# Altium project ClassD_Amp.PrjPcb
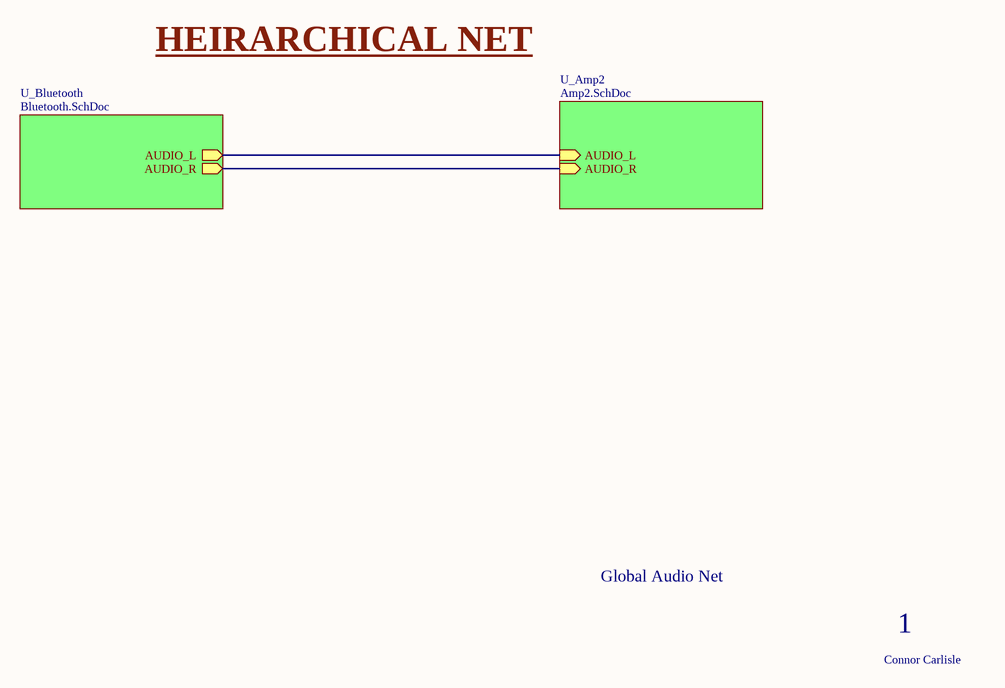
[diagram p0: Top_Sheet.SchDoc]
3 sheets, 68 parts. Net scope: hierarchical (ports join the sheet entries above them; power ports are global).
Board file: PCB1.PcbDoc
Sheets:
  Top_Sheet.SchDoc
    U_Amp2 = Amp2.SchDoc
    U_Bluetooth = Bluetooth.SchDoc

## Sheet Top_Sheet.SchDoc
size A; SheetNumber: 1; SheetTotal: 3

### Sub-sheets
U_Amp2 = Amp2.SchDoc: AUDIO_L (in), AUDIO_R (in)
U_Bluetooth = Bluetooth.SchDoc: AUDIO_L (out), AUDIO_R (out)

### Nets
NetR2_1: sheet U_Amp2/AUDIO_L, sheet U_Bluetooth/AUDIO_L
NetR4_1: sheet U_Amp2/AUDIO_R, sheet U_Bluetooth/AUDIO_R

### Notes on the sheet
- HEIRARCHICAL NET
- Global Audio Net
- 1
- Connor Carlisle

## Sheet Amp2.SchDoc
size A; SheetNumber: 2; SheetTotal: 3
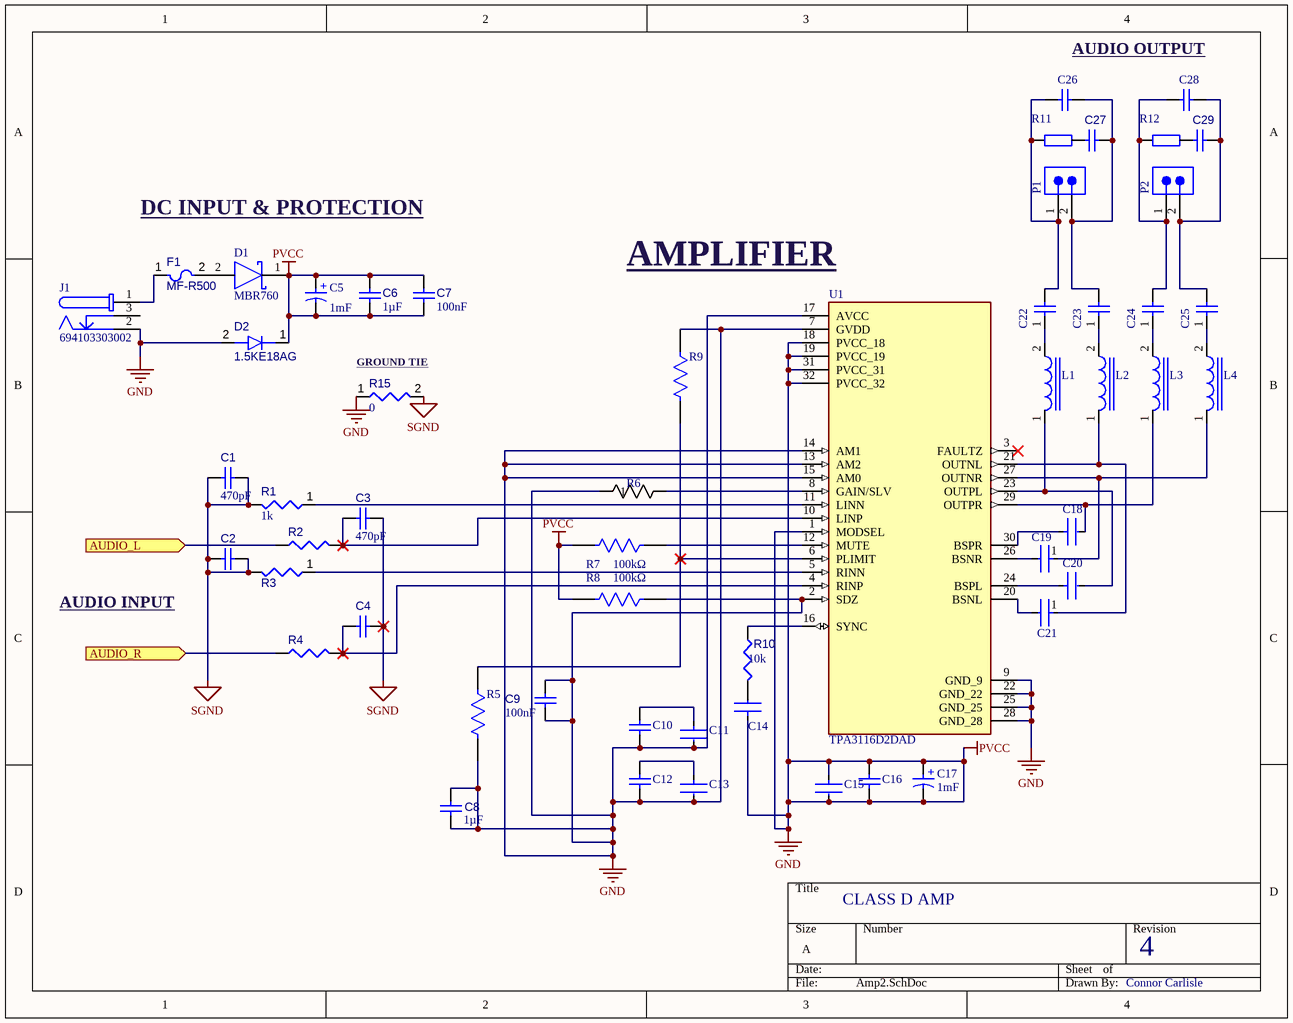
[diagram p1: Amp2.SchDoc]

### Parts
C1  value 470pF  [CAPC0402(1005)60_L]  (hidden comment: Capacitor 470pF +/-20% 50V 0402)
C2  Capacitor 470pF +/-20% 50V 0402  [CAPC0402(1005)60_L]  (value not drawn)
C3  value 470pF  [CAPC0402(1005)60_L]  (hidden comment: Capacitor 470pF +/-20% 50V 0402)
C4  Capacitor 470pF +/-20% 50V 0402  [CAPC0402(1005)60_L]  (value not drawn)
C5  Capacitance: 1mF  [WCAP-ATG8_D10H20]  (hidden comment: 860010475017)
C6  value 1µF  [CAPC0402(1005)60_L]  (hidden comment: Capacitor 1µF +/-20% 10V 0402)
C7  value 100nF  [CAPC0402(1005)60_L]  (hidden comment: Capacitor 100nF +/-20% 25V 0402)
C8  value 1µF  [CAPC0402(1005)60_L]  (hidden comment: Capacitor 1µF +/-20% 10V 0402)
C9  value 100nF  [CAPC0402(1005)60_L]  (hidden comment: Capacitor 100nF +/-20% 25V 0402)
C10  0805YD105MAT2A  [CAPC2013X140X50NL20T25]  (value not drawn)
C11  JWK105BJ104MP-F  [FP-0204-L_0_52_0_05-W_1_0-IPC_C]  (value not drawn)
C12  0805YD105MAT2A  [CAPC2013X140X50NL20T25]  (value not drawn)
C13  JWK105BJ104MP-F  [FP-0204-L_0_52_0_05-W_1_0-IPC_C]  (value not drawn)
C14  VY1102M35Y5UQ6TV0  [FP-VY1102M35Y5UQ6TV0-MFG]  (value not drawn)
C15  JWK105BJ104MP-F  [FP-0204-L_0_52_0_05-W_1_0-IPC_C]  (value not drawn)
C16  0805YD105MAT2A  [CAPC2013X140X50NL20T25]  (value not drawn)
C17  Capacitance: 1mF  [WCAP-ATG8_D10H20]  (hidden comment: 860010475017)
C18  08051C224K4T2A  [FP-0805-L_2_01_0_2-W_1_25-MFG]  (value not drawn)
C19  08051C224K4T2A  [FP-0805-L_2_01_0_2-W_1_25-MFG]  (value not drawn)
C20  08051C224K4T2A  [FP-0805-L_2_01_0_2-W_1_25-MFG]  (value not drawn)
C21  08051C224K4T2A  [FP-0805-L_2_01_0_2-W_1_25-MFG]  (value not drawn)
C22  890334026020  [WCAP-FTXX_L26W7.5H15]  (value not drawn)
C23  890334026020  [WCAP-FTXX_L26W7.5H15]  (value not drawn)
C24  890334026020  [WCAP-FTXX_L26W7.5H15]  (value not drawn)
C25  890334026020  [WCAP-FTXX_L26W7.5H15]  (value not drawn)
C26  CAP 680nF 16V 0805(2012)  [CAPC0805(2012)145_M]  (value not drawn)
C27  Capacitor 10nF +/-20% 50V 0402  [CAPC0402(1005)60_L]  (value not drawn)
C28  CAP 680nF 16V 0805(2012)  [CAPC0805(2012)145_M]  (value not drawn)
C29  Capacitor 10nF +/-20% 50V 0402  [CAPC0402(1005)60_L]  (value not drawn)
D1  MBR760  [FP-340BA-MFG]
D2  1.5KE18AG  [FUSE_1.5KE_LTF]
F1  MF-R500  [FUSE_MF-R500_BRN]
J1  694103303002  [694103303002]
L1  SRR1260-100M  [INDP125125X600N]  (value not drawn)
L2  SRR1260-100M  [INDP125125X600N]  (value not drawn)
L3  SRR1260-100M  [INDP125125X600N]  (value not drawn)
L4  SRR1260-100M  [INDP125125X600N]  (value not drawn)
P1  691311400002  [691311400002]  (value not drawn)
P2  691311400002  [691311400002]  (value not drawn)
R1  value 1k  [RESA60-630X240]  (hidden comment: MFR-25FBF52-1K)
R2  MFR-25FBF52-1K  [RESA60-630X240]  (value not drawn)
R3  MFR-25FBF52-1K  [RESA60-630X240]  (value not drawn)
R4  MFR-25FBF52-1K  [RESA60-630X240]  (value not drawn)
R5  MRS16000C2002FCT00  [FP-MRS1600-MFG]  (value not drawn)
R6  6-1625890-6  [RES_6-1625890-6_TEC]  (value not drawn)
R7  Resistance: 100kΩ  [FP-PR02000201003JA100-MFG]  (hidden comment: PR02000201003JA100)
R8  Resistance: 100kΩ  [FP-PR02000201003JA100-MFG]  (hidden comment: PR02000201003JA100)
R9  PTF56250K00FZEB  [FP-PTF56-MFG]  (value not drawn)
R10  value 10k  [RESA60-630X240]  (hidden comment: MFR-25FBF52-10K)
R11  560050363012  [WRIS-KSKE_2512]  (value not drawn)
R12  560050363012  [WRIS-KSKE_2512]  (value not drawn)
R15  value 0  [RESC0402(1005)_L]  (hidden comment: 0R2J)
U1  TPA3116D2DAD  [SOP65P810X115-32N]

### Ports
AUDIO_L (in), AUDIO_R (in)

### Nets
GND: C5.1(P) C5.2(N) C6.1 C6.2 C7.1 C7.2 C8.1 C8.2 C9.1 C9.2 C10.2 C11.2 C12.2 C13.2 C14.2 C15.1 C15.2 C16.1 C16.2 C17.1(P) C17.2(N) D1.1(C) D2.1(K) D2.2(A) J1.2 R5.2 R6.1 R7.2 R8.1 R8.2 R9.1 R15.1 U1.1(MODSEL) U1.2(SDZ) U1.7(GVDD) U1.9(GND_9) U1.13(AM2) U1.14(AM1) U1.15(AM0) U1.17(AVCC) U1.18(PVCC_18) U1.19(PVCC_19) U1.22(GND_22) U1.25(GND_25) U1.28(GND_28) U1.31(PVCC_31) U1.32(PVCC_32)  [also labelled PVCC]
SGND: C1.1 C1.2 C2.1 C2.2 C3.2 C4.2 R1.2 R3.2 R15.2
NetC3_1: C3.1 R2.2 U1.10(LINP)
NetC4_1: C4.1 R4.2 U1.4(RINP)
NetC10_1: C10.1 C11.1
NetC12_1: C12.1 C13.1
NetC14_1: C14.1 R10.2
NetC18_1: C18.1 U1.30(BSPR)
NetC18_2: C18.2 L3.1 U1.29(OUTPR)
NetC19_1: C19.1 L4.1 U1.27(OUTNR)
NetC19_2: C19.2 U1.26(BSNR)
NetC20_1: C20.1 U1.24(BSPL)
NetC20_2: C20.2 L1.1 U1.23(OUTPL)
NetC21_1: C21.1 L2.1 U1.21(OUTNL)
NetC21_2: C21.2 U1.20(BSNL)
NetC22_1: C22.1 L1.2
NetC22_2: C22.2 C26.1 P1.1 R11.1
NetC23_1: C23.1 L2.2
NetC23_2: C23.2 C26.2 C27.2 P1.2
NetC24_1: C24.1 L3.2
NetC24_2: C24.2 C28.1 P2.1 R12.1
NetC25_1: C25.1 L4.2
NetC25_2: C25.2 C28.2 C29.2 P2.2
NetD1_2: D1.2(A) F1.2
NetF1_1: F1.1 J1.1
NetR1_1: R1.1 U1.11(LINN)
NetR2_1: R2.1 ; port AUDIO_L
NetR3_1: R3.1 U1.5(RINN)
NetR4_1: R4.1 ; port AUDIO_R
NetR5_1: R5.1 R9.2 U1.6(PLIMIT)
NetR6_2: R6.2 U1.8(GAIN/SLV)
NetR7_1: R7.1 U1.12(MUTE)
NetR10_1: R10.1 U1.16(SYNC)

Not connected (* = marked no-connect by the designer): C27 1; C29 1; J1 3; R11 2; R12 2; U1 3(FAULTZ)*

### Notes on the sheet
- AUDIO OUTPUT
- DC INPUT & PROTECTION
- AMPLIFIER
- (near R15) GROUND TIE
- AUDIO INPUT
- CLASS D AMP
- 4
- Connor Carlisle
- (in symbol CMP-03913-54007218-1) +

### Library data of the parts
C1-C4 = CMP-001-00068-4: Chip Capacitor, 470pF +/-20%, 50V, 0402, Thickness 0.6 mm; Tolerance: 20%; Mounting Technology: SMT; Max Operating Temperature: 85°C; Min Operating Temperature: -55°C; Pins: 2; Voltage Rating: 50V; Case/Package: 0402
  C2 C4: Value: 470pF
C5 C17 = CMP-03913-54007218-1: 860010475017 Aluminum Electrolytic Capacitor, Aluminum (wet); Life (Hours): 2000hours; Polarity: Polar; Leakage Current: 250µA; Voltage Rating (DC): 25V; Tolerance: 20%; Pitch: 5mm; Material: Aluminium; Ripple Current: 1.05A; Height: 20mm; Length: 20mm; Height - Seated (Max): 21.4884mm; Voltage Rating: 25V; Mount: Through Hole; Lead Pitch: 5.0038mm; REACH SVHC: Unknown; Case/Package: Radial; Max Operating Temperature: 85°C; Min Operating Temperature: -40°C; RoHS: Compliant; Diameter: 10mm; Packaging: Cut Tape (CT); NexarPartId: 54007218
C6 C8 = CMP-001-00063-3: Chip Capacitor, 1µF +/-20%, 10V, 0402, Thickness 0.6 mm; Tolerance: 10%; Mounting Technology: SMT; Max Operating Temperature: 85°C; Voltage Rating: 10V; Pins: 2; Case/Package: 0402; Min Operating Temperature: -55°C
C7 C9 = CMP-001-00065-4: Chip Capacitor, 100nF +/-20%, 25V, 0402, Thickness 0.6 mm; Tolerance: 10%; Max Operating Temperature: 85°C; Min Operating Temperature: -55°C; Pins: 2; Voltage Rating: 25V; Mounting Technology: SMT; Case/Package: 0402
C10 C12 C16 = CMP-2007-04663-1: 1 microfarad; Manufacturer: AVX Interconnect / Elco; Part Number: 0805YD105MAT2A
C11 C13 C15 = CMP-14477-001862-2: .1 microfarad; Voltage Rating (DC): 6.3V; Tolerance: 20%; Capacitance: 100nF; RoHS Compliant: Yes; Halogen Free: Halogen Free
C14 = CMP-02417-000063-1: CAP CER 1000PF 760VAC Y5U RADIAL; Voltage: 500V; Capacitance: 1nF; Lead Diameter: 0.6mm; Lead/Base Style: Kinked; Tolerance: 20%; Construction: RADIAL; Dielectric: Y5U; RoHS Compliant: Yes; Resistor Type: Ceramic; Min Operating Temperature: -40°C; Height - Seated (Max): 0.512inch; Series: VY1; Diameter: 9mm; Voltage Rating (AC): 500V; Termination: Radial; Depth: 5mm; Radiation Hardening: No; Lead Pitch: 10mm; Package Quantity: 500; Case/Package: Radial; Height: 12mm; Contact Plating: Tin; Voltage Rating (DC): 500V; Max Operating Temperature: 125°C; Packaging: Tape and Reel; Mount: Through Hole
C18-C21 = CMP-04427-012849-1: Automotive Ceramic Capacitor, 0805, 220nF, 10%, X7R, 15%, 100V; Capacitance: 220nF; Voltage Rating (DC): 100V; Dielectric: X7R; Length: 2.01mm; Contact Plating: Tin; Termination: Wraparound; Case/Package: 0805; RoHS Compliant: Yes; Tolerance: 10%; Max Operating Temperature: 125°C; Min Operating Temperature: -55°C; Mount: Surface Mount
C22-C25 = CMP-03913-52220399-4: Film Capacitor, WCAP-FTXX Series, 0.68 F, 10%, PP (Polypropylene), 310 VAC; Pin Length: 18mm; Hole Diameter: 1.1mm; Voltage Rating (AC): 310V; Insulation Resistance: 14.71GΩ; Pitch: 22.5mm; Capacitance: 680nF; Tolerance: 10%; Mount: Through Hole; Width: 7.5mm; Lead Pitch: 22.5044mm; Max Operating Temperature: 105°C; RoHS: Compliant; Dielectric: PP; Height - Seated (Max): 15.494mm; Height: 15mm; Packaging: Bulk; Length: 26mm; Dielectric Material: PP; Termination: PC Pins; Voltage Rating (DC): 310V; Case/Package: Radial; Voltage Rating: 310V; REACH SVHC: Unknown; Min Operating Temperature: -40°C
C26 C28 = CMP-1036-04697-1: CAP 680nF 16V ±10% 0805 (2012 Metric) Thickness 1.45mm SMD; Tolerance: Â±10%; Case-EIA: 0805; Case-Metric: 2012; Rated Voltage: 16 V; Technology: SMT; Max Thickness: 1.45 mm; Value: 680nF
C27 C29 = CMP-001-00069-3: Chip Capacitor, 10nF +/-20%, 50V, 0402, Thickness 0.6 mm; Tolerance: 5%; Max Operating Temperature: 85°C; Pins: 2; Case/Package: 0402; Voltage Rating: 50V; Min Operating Temperature: -55°C; Mounting Technology: SMT; Value: 10nF
D1 = CMP-00278-20838014-1: MBR760 Diode Schottky 60V 7.5A 2-Pin(2+Tab) TO-220AC Rail; Manufacturer Lifecycle Status: ACTIVE; Max Forward Surge Current (Ifsm): 150A; Forward Voltage: 750mV; Peak Reverse Current: 500µA; Polarity: Standard; Element Configuration: Single; Output Current: 7.5A; Voltage Rating (DC): 60V; Max Operating Temperature: 150°C; Weight: 2.16g; Lifecycle Status: Production; Radiation Hardening: No; RoHS: Compliant; Average Rectified Current: 7.5A; Max Repetitive Reverse Voltage (Vrrm): 60V; Current Rating: 7.5A; Max Reverse Voltage (DC): 60V; Case/Package: TO-220-2; Max Surge Current: 150A; Lead Free: Lead Free; Min Operating Temperature: -65°C; Number of Pins: 2; Max Reverse Leakage Current: 500µA; Forward Current: 7.5A; Mount: Through Hole; NexarPartId: 20838014; Peak Non-Repetitive Surge Current: 150A
D2 = CMP-004-00035-2: Diode TVS Single Uni-Dir 15.3V 1.5KW 2-Pin Case 41A-04 Box; Max Surge Current: 59.5A; Case/Package: Axial; Min Operating Temperature: -65°C; Pins: 2; Max Operating Temperature: 150°C
F1 = CMP-005-00015-1: PTC Resettable Fuse 5A(hold) 10A(trip) 30V 40A 3W 14.5s 0.01Ohm Radial 17.4 X 3 X 24.9mm Bulk Automotive; Min Operating Temperature: -40°C; Case/Package: Radial; Mounting Technology: PCB, Through Hole; Current Rating: 5A; Max Operating Temperature: 85°C
J1 = CMP-1502-00185-3: DC Power Jack Connector WR-DC, Male, Right Angled, THT, 2 A, 30 V; Operating Supply Voltage: 30V; Insulation Resistance: 100MΩ; Shielding: Unshielded; Current Rating: 2A; Color: Black; Min Operating Temperature: -40°C; Connector Type: Power; REACH SVHC: Unknown; Housing Material: Polyamide; Termination: Through Hole; Gender: Male; Contact Gender: Female; Flammability Rating: UL94 V-0; RoHS: Compliant; Mount: Through Hole; Contact Plating: Tin; Packaging: Bulk; Max Operating Temperature: 85°C; Voltage Rating (DC): 30V; Voltage Rating: 30V
L1-L4 = CMP-006-00021-1: 10ÂµH Shielded Wirewound Inductor 5.5A 20mOhm Max Nonstandard; MF: Bourns - J.W. Miller; Source: SnapEDAsch.SchLib; SnapEDA_Link: https://www.snapeda.com/parts/SRR1260-100M/Bourns%20-%20J.W.%20Miller/view-part/50172/?ref=snap; Case/Package: Nonstandard Bourns - J.W. Miller; Component Type: Standard; MP: SRR1260-100M; Design Item ID: SRR1260-100M; Price: None; Pins: 2; Availability: Unavailable
P1 P2 = CMP-1502-02400-3: 7.62MM Pitch Straight Pluggable Term Block, Pcb Header, Through Hole, 2 Way; Connector Type: PCB, Terminal Block; Gender: Male; Number of Levels: 1; Voltage: 300V; Current: 20A; Number of Contacts: 2; Number of Rows: 1; RoHS: Compliant; Contact Material: Brass; REACH SVHC: Unknown; Width: 13.42mm; Termination: Solder; Height: 16mm; Color: Green; Lead Pitch: 7.62mm; Contact Gender: Male; Pitch: 7.62mm; Packaging: Box; Number of Pins: 2; Mount: Through Hole; Number of Positions Per Level: 2; Length: 8.5mm; Orientation: Vertical
R1 = CMP-009-00048-4: Axial Resistor, 1 KOhm, +/- 1%, 250 mW, -55 to 155 degC, 2-Pin THD, RoHS, Bulk; Manufacturer: Yageo; Voltage Rating: 250V; Power: 250mW; Min Operating Temperature: -55°C; Max Operating Temperature: 155°C; Tolerance: 1%; Package Reference: MFR-25; Composition: CarbonFilm; Mounting Technology: TH; Packaging: Bulk; Case/Package: Axial; Datasheet URL: http://www.yageo.com/documents/recent/Yageo%20LR_MFR_2013.pdf; Package Quantity: 200; Manufacturer URL: http://www.yageo.com/; Package Description: 2-Pin Axial Lead, Dia 2.4 mm, Body Length 6.3 mm; Datasheet Version: Apr-13; RoHS Compliant: True
R2-R4 = CMP-009-00048-4: Axial Resistor, 1 KOhm, +/- 1%, 250 mW, -55 to 155 degC, 2-Pin THD, RoHS, Bulk; Manufacturer: Yageo; Voltage Rating: 250V; Value: 1k; Power: 250mW; Min Operating Temperature: -55°C; Max Operating Temperature: 155°C; Tolerance: 1%; Package Reference: MFR-25; Composition: CarbonFilm; Mounting Technology: TH; Packaging: Bulk; Case/Package: Axial; Datasheet URL: http://www.yageo.com/documents/recent/Yageo%20LR_MFR_2013.pdf; Package Quantity: 200; Manufacturer URL: http://www.yageo.com/; Package Description: 2-Pin Axial Lead, Dia 2.4 mm, Body Length 6.3 mm; Datasheet Version: Apr-13; RoHS Compliant: True
R5 = CMP-02408-000019-1: RES 20K OHM 0.4W 1% AXIAL; Max Power Dissipation: 400mW; Temperature Coefficient: 50ppm/°C; Resistance: 20kR; Technology: THIN FILM; Max Operating Temperature: 155°C; Number of Terminations: 2; RoHS Compliant: Yes; Packaging: Tape and Reel; Radiation Hardening: No; Contact Plating: Tin; Military Standard: Not; Construction: Cylindrical; Diameter: 1.6mm; Tolerance: 1%; Mount: Through Hole; Power Rating: 400mW; Case/Package: Conformal; Termination: Axial; Length: 3.6mm; Min Operating Temperature: -55°C; Resistor Type: Metal Film; Series: MRS16
R6 = CMP-009-00180-2: 5.6k; Manufacturer_Name: TE Connectivity; Manufacturer_Part_Number: 6-1625890-6; Source: 6-1625890-6.SchLib; Copyright: Copyright (C) 2026 Ultra Librarian. All rights reserved.; Design Item ID: 6-1625890-6
R7 R8 = CMP-00030-42817933-1: PR02000201003JA100 Fixed Resistor, Metal Film, 2W, 100000ohm, 500V, 5% +/-Tol, 250ppm/Cel, Through Hole Mount; Temperature Coefficient: 250ppm/°C; Case/Package: Conformal; Lead Free: Lead Free; Composition: Metal Film; Schedule B: 8533210090, 8533210090; Tolerance: 5%; RoHS: Compliant; Min Operating Temperature: -55°C; NexarPartId: 42817933; Diameter: 3.9mm; Max Operating Temperature: 155°C; Voltage Rating: 500V; Length: 12mm; Width: 3.9mm; Contact Plating: Tin; REACH SVHC: No SVHC; Operating Supply Voltage: 500V; Termination: Axial; Power Rating: 2W; Military Standard: Not; Radiation Hardening: No; Mount: Through Hole; Voltage Rating (DC): 500V
R9 = CMP-00030-29520625-1: PTF56250K00FZEB Res Metal Film 250kOhm 1% ± 5ppm/°C 1/8W Axial Leaded T/R; Resistance: 250kΩ; Lead Diameter: 640µm; Voltage Rating: 300V; Power Rating: 125mW; Mount: Through Hole; Temperature Coefficient: 5ppm/°C; NexarPartId: 29520625; Min Operating Temperature: -55°C; Length: 6.35mm; RoHS: Compliant; Composition: Metal Film; Case/Package: Axial; Weight: 350.003213mg; Height: 2.54mm; Max Operating Temperature: 150°C; Termination: Axial; Tolerance: 1%
R10 = CMP-009-00047-4: Axial Resistor, 10 KOhm, +/- 1%, 0.25 W, -55 to 155 degC, 2-Pin THD, RoHS, Bulk; Manufacturer: Yageo; Power: 250mW; Voltage Rating: 250V; Manufacturer URL: http://www.yageo.com/; Datasheet URL: http://www.yageo.com/documents/recent/Yageo%20LR_MFR_2013.pdf; Package Reference: MFR-25; Min Operating Temperature: -55°C; Mounting Technology: TH; Package Quantity: 200; Case/Package: Axial; Tolerance: 1%; RoHS Compliant: True; Datasheet Version: Apr-13; Packaging: Bulk; Max Operating Temperature: 155°C; Package Description: 2-Pin Axial Lead, Dia 2.4 mm, Body Length 6.3 mm
R11 R12 = CMP-03913-130378563-3: Res, 3R3, 1%, 1W, Thick Film, 2512 Rohs Compliant: Yes; Current Rating: 550mA; Resistance: 3.3Ω; Voltage Rating: 1.8166V; Width: 3.2mm; Height: 600µm; Min Operating Temperature: -55°C; RoHS: Compliant; Max Operating Temperature: 155°C; Length: 6.3mm
R15 = CMP-009-00062-2: Jumper 0402 (1005 Metric); Pins: 2; Mounting Technology: SMT; Case/Package: 0402
U1 = CMP-014-00003-1: 50-W stereo, 100-W mono, 4.5- to 26-V supply, analog input Class-D audio amplifier w/ SpeakerGuardâ„¢; MF: Texas Instruments; Design Item ID: TPA3116D2DAD; MP: TPA3116D2DAD; Source: TPA3116D2DAD.SchLib; Component Type: Standard; Value: *; Case/Package: HTSSOP-32 Texas Instruments; SnapEDA_Link: https://www.snapeda.com/parts/TPA3116D2DAD/Texas+Instruments/view-part/?ref=snap; Check_prices: https://www.snapeda.com/parts/TPA3116D2DAD/Texas+Instruments/view-part/?ref=eda; Pins: 32

## Sheet Bluetooth.SchDoc
size A; SheetNumber: 3; SheetTotal: 3
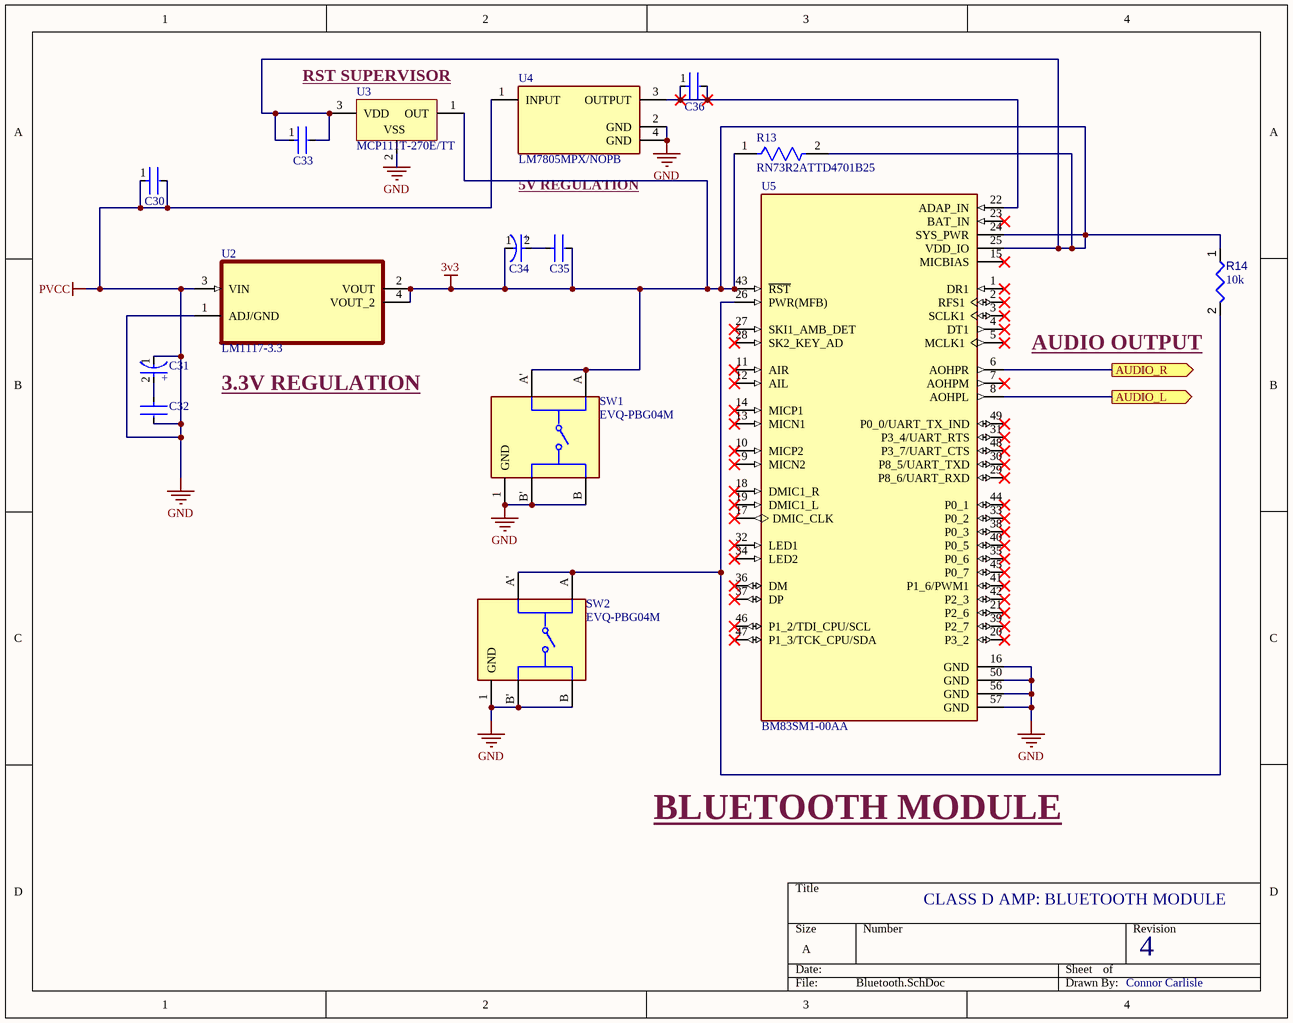
[diagram p2: Bluetooth.SchDoc]

### Parts
C30  JWK105BJ104MP-F  [FP-0204-L_0_52_0_05-W_1_0-IPC_C]  (value not drawn)
C31  ECA1HHG100I  [FP-RAD-TH-D_5_0_5-L_11_1-MFG]  (value not drawn)
C32  JWK105BJ104MP-F  [FP-0204-L_0_52_0_05-W_1_0-IPC_C]  (value not drawn)
C33  JWK105BJ104MP-F  [FP-0204-L_0_52_0_05-W_1_0-IPC_C]  (value not drawn)
C34  ECA1HHG100I  [FP-RAD-TH-D_5_0_5-L_11_1-MFG]  (value not drawn)
C35  JWK105BJ104MP-F  [FP-0204-L_0_52_0_05-W_1_0-IPC_C]  (value not drawn)
C36  JWK105BJ104MP-F  [FP-0204-L_0_52_0_05-W_1_0-IPC_C]  (value not drawn)
R13  RN73R2ATTD4701B25  [FP-RN73R2A-IPC_C]
R14  value 10k  [RESA60-630X240]  (hidden comment: MFR-25FBF52-10K)
SW1  EVQ-PBG04M  [FP-EVQ-PBG04M-MFG]
SW2  EVQ-PBG04M  [FP-EVQ-PBG04M-MFG]
U2  LM1117-3.3  [SOT230]
U3  MCP111T-270E/TT  [SOT-23-TT3_N]
U4  LM7805MPX/NOPB  [FP-LM7805MPX-NOPB-MFG]
U5  BM83SM1-00AA  [XCVR_BM83SM1-00AA]

### Ports
AUDIO_L (out), AUDIO_R (out)

### Nets
3v3: C33.1 C33.2 C34.1(C) C35.2 R13.1 R13.2 R14.1 SW1.A SW1.A' U2.2(VOUT) U2.4(VOUT_2) U3.1(OUT) U3.3(VDD) U5.24(SYS_PWR) U5.25(VDD_IO) U5.43(~{RST})
GND: C30.1 C30.2 C31.1(C) C32.2 SW1.1(GND) SW1.B SW1.B' SW2.1(GND) SW2.B SW2.B' U2.1(ADJ/GND) U2.3(VIN) U3.2(VSS) U4.1(INPUT) U4.2(GND) U4.4(GND) U5.16(GND) U5.50(GND) U5.56(GND) U5.57(GND)  [also labelled PVCC]
NetC31_2: C31.2(A) C32.1
NetC34_2: C34.2(A) C35.1
NetC36_1: C36.1 C36.2 U4.3(OUTPUT) U5.22(ADAP_IN)
NetR2_1: U5.8(AOHPL) ; port AUDIO_L
NetR4_1: U5.6(AOHPR) ; port AUDIO_R
NetR14_2: R14.2 SW2.A SW2.A' U5.26(PWR(MFB))

Not connected (* = marked no-connect by the designer): U5 1(DR1)* 2(RFS1)* 3(SCLK1)* 4(DT1)* 5(MCLK1)* 7(AOHPM)* 9(MICN2)* 10(MICP2)* 11(AIR)* 12(AIL)* 13(MICN1)* 14(MICP1)* 15(MICBIAS)* 17(DMIC_CLK)* 18(DMIC1_R)* 19(DMIC1_L)* 20(P3_2)* 21(P2_6)* 23(BAT_IN)* 27(SKI1_AMB_DET)* 28(SK2_KEY_AD)* 29(P8_6/UART_RXD)* 30(P8_5/UART_TXD)* 31(P3_4/UART_RTS)* 32(LED1)* 33(P0_2)* 34(LED2)* 35(P0_6)* 36(DM)* 37(DP)* 38(P0_3)* 39(P2_7)* 40(P0_5)* 41(P1_6/PWM1)* 42(P2_3)* 44(P0_1)* 45(P0_7)* 46(P1_2/TDI_CPU/SCL)* 47(P1_3/TCK_CPU/SDA)* 48(P3_7/UART_CTS)* 49(P0_0/UART_TX_IND)*

### Notes on the sheet
- (near U3) RST SUPERVISOR
- 5V REGULATION
- AUDIO OUTPUT
- 3.3V REGULATION
- BLUETOOTH MODULE
- CLASS D AMP: BLUETOOTH MODULE
- 4
- Connor Carlisle
- (in symbol CMP-05427-000260-1) +

### Library data of the parts
C30 C32 C33 C35 C36 = CMP-14477-001862-2: as C11 on sheet Amp2; RoHS Compliant: Yes; Halogen Free: Halogen Free
C31 C34 = CMP-05427-000260-1: Aluminum Electrolytic Capacitors (Radial Lead Type) AEC-Q200 Qualified 10uF ±20% 50V; Lead Diameter: 0.5mm; Polarity: Polar; Leakage Current: 3uA; Life (Hours): 1000Hour; Ripple Current: 39mA; Lead/Base Style: Straight; Max Operating Temperature: 105°C; Voltage Rating (DC): 50V; Diameter: 5mm; RoHS Compliant: Yes; Capacitance: 10uF; Packaging: Ammo Pack; Series: NHG; Construction: RADIAL; Length: 11mm; Tolerance: 20%; Height - Seated (Max): 0.472inch; Contact Plating: Tin; Height: 11mm; Min Operating Temperature: -55°C; Radiation Hardening: No; Package Quantity: 2000; Mount: Through Hole; Voltage Rating: 50V; Lead Pitch: 2.5mm; Termination: Radial; Lead Free: Lead Free; Case/Package: Radial
R13 = CMP-04015-010540-1: 4.7kΩ ±0.1% 0.125W, 1/8W Chip Resistor 0805 (2012 Metric) Moisture Resistant Thin Film
R14 = CMP-009-00047-4: as R10 on sheet Amp2; Manufacturer URL: http://www.yageo.com/; Datasheet URL: http://www.yageo.com/documents/recent/Yageo%20LR_MFR_2013.pdf; Package Reference: MFR-25; Min Operating Temperature: -55°C; Mounting Technology: TH; Package Quantity: 200; Case/Package: Axial; Tolerance: 1%; RoHS Compliant: True; Datasheet Version: Apr-13; Packaging: Bulk; Max Operating Temperature: 155°C; Package Description: 2-Pin Axial Lead, Dia 2.4 mm, Body Length 6.3 mm
SW1 SW2 = CMP-05618-000021-1: SWITCH TACTILE SPST-NO 0.02A 15V; Actuator Length: 0.4mm; Actuator Type: Standard; Actuator Color: White; Current Rating: 20mA; Electrical Life: 50000Cycles; Switch Travel: 0.25mm; Contact Resistance: 50mR; Operating Force: 2.6N; Illumination Type: Non-Illuminated; Throw Configuration: SPST; Switch Function: Off-Mom; Size: 6mm; Lead Free: Lead Free; Series: EVQPB; Radiation Hardening: No; Package Quantity: 500; Max Operating Temperature: 70°C; Contact Current Rating: 20mA; Max Voltage Rating (DC): 15V; Packaging: Bulk; RoHS Compliant: Yes; Mount: Through Hole; Termination: PC Pin; Orientation: Straight; Voltage Rating (DC): 15V; Min Operating Temperature: -20°C; Mechanical Life: 50000Cycles
U2 = CMP-010-000000-6: Regulador de tensÃ£o linear IC 1 Output 800mA SOT-223-4; MF: Texas Instruments; MP: LM1117-3.3; Source: SnapEDAsch.SchLib; Price: None; Pin Count: 4; SnapEDA_Link: https://www.snapeda.com/parts/LM1117-3.3/Texas%20Instruments/view-part/549181/?ref=snap; Value: *; Package: SOT-223-4 Texas Instruments; Design Item ID: LM1117-3.3; Availability: Unavailable; Component Type: Standard
U3 = CMP-019-00050-1: Microchip MCP111T-270E/TT, Voltage Supervisor 2.564 to 2.696 V, 3-PIN SOT-23B; Min Supply Voltage: 1V; Nominal Supply Current: 1µA; Max Supply Voltage: 5.5V; Max Operating Temperature: 125°C; Mounting Technology: Surface Mount; Pins: 3; Case/Package: SOT-23; Min Operating Temperature: -40°C
U4 = CMP-04917-000022-1: IC REG LINEAR 5V 1.5A SOT223-4; Manufacturer: Texas Instruments; Dropout Voltage: 2V; Output Type: Fixed; Accuracy Percentage: 3%; Nominal Supply Current: 8mA; Standoff Height: 0.02mm; Min Supply Voltage: 7.5V; Number Of Outputs: 1; Max Junction Temp: +150°C; Max Supply Voltage: 30V; Height: 1.8mm; Temperature Range High: +125°C; Device Class L3: Voltage Regulators - Linear; Lead Free: Yes; Digikey Description: IC REG LINEAR 5V 1.5A SOT223-4; Output Current: 1.5A; Manufacturer Part Number: LM7805MPX/NOPB; Automotive: No; Device Class L1: Integrated Circuits (ICs); ComponentLink2Description: Datasheet; Device Class L2: Power Management ICs; Category: IC; Octopart: https://octopart.com/lm7805mpx%2Fnopb-texas+instruments-74629992; Package: SOT223-4; RoHS: TRUE; Output Voltage: 5V; Temperature Range Low: 0°C; Temperature: 0°C to +125°C; ComponentLink2URL: http://www.ti.com/lit/ds/symlink/lm7800.pdf
U5 = CMP-008-000000-1: Bluetooth Bluetooth v5.0 Transceiver Module 2.4GHz ~ 2.48GHz PCB Trace Surface Mount; MF: Microchip Technology; MP: BM83SM1-00AA; Package: None; Pin Count: 52; Design Item ID: BM83SM1-00AA; Check_prices: https://www.snapeda.com/parts/BM83SM1-00AA/Microchip/view-part/?ref=eda; Component Type: Standard; SnapEDA_Link: https://www.snapeda.com/parts/BM83SM1-00AA/Microchip/view-part/?ref=snap; Value: *; Source: BM83SM1-00AA.SchLib

## Nets that join several sheets
GND: Amp2 (47 pins), Bluetooth (20 pins)
NetR2_1: Amp2 (R2.1), Bluetooth (U5.8)
NetR4_1: Amp2 (R4.1), Bluetooth (U5.6)